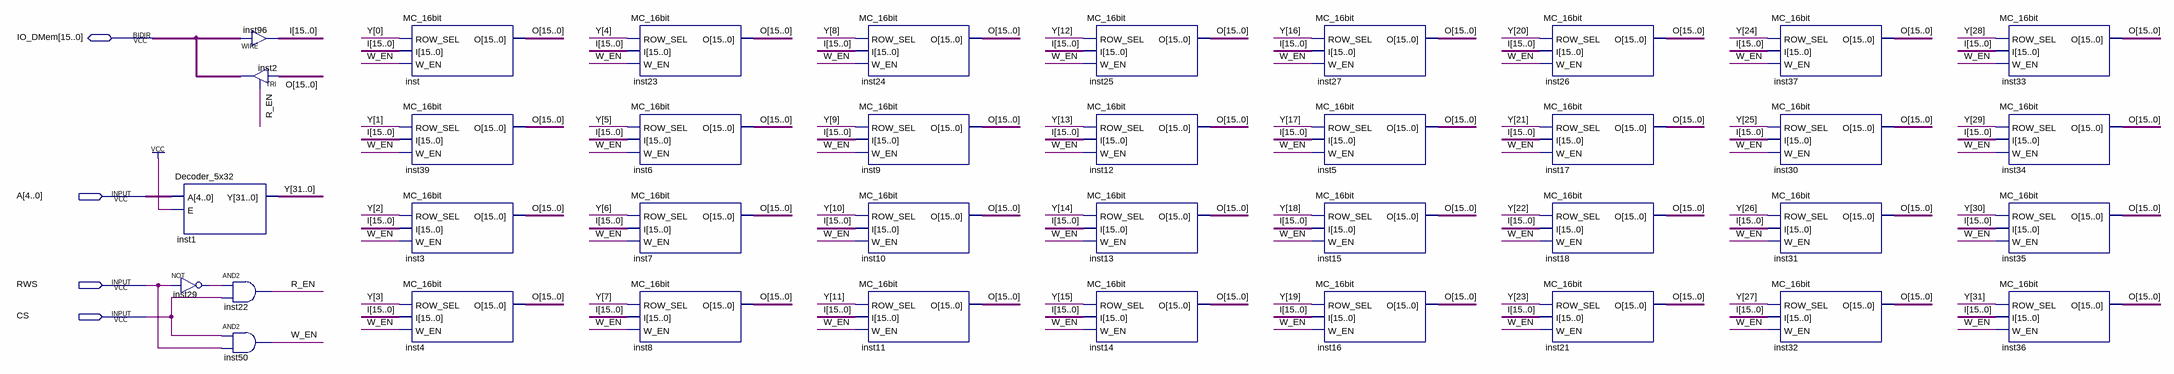
[diagram p0: schematic sheet]
// Quartus schematic DMem_32x16.bdf as structural Verilog: 38 symbols, 4 pins
module DMem_32x16 (
  input  [4:0] A,
  input  RWS,
  input  CS,
  inout  [15:0] IO_DMem
);

  wire inst29_out, R_EN, W_EN;
  wire [15:0] I, O;
  wire [31:0] Y;

  Decoder_5x32 inst1 (.A(A), .E(1'b1), .Y(Y));
  not inst29 (inst29_out, RWS);
  and inst22 (R_EN, inst29_out, CS);
  and inst50 (W_EN, CS, RWS);
  assign I = IO_DMem;  // WIRE inst96
  TRI inst2[15:0] (.IN(O), .OE(R_EN), .OUT(IO_DMem));
  MC_16bit inst (.ROW_SEL(Y[0]), .I(I), .W_EN(W_EN), .O(O));
  MC_16bit inst39 (.ROW_SEL(Y[1]), .I(I), .W_EN(W_EN), .O(O));
  MC_16bit inst3 (.ROW_SEL(Y[2]), .I(I), .W_EN(W_EN), .O(O));
  MC_16bit inst4 (.ROW_SEL(Y[3]), .I(I), .W_EN(W_EN), .O(O));
  MC_16bit inst23 (.ROW_SEL(Y[4]), .I(I), .W_EN(W_EN), .O(O));
  MC_16bit inst6 (.ROW_SEL(Y[5]), .I(I), .W_EN(W_EN), .O(O));
  MC_16bit inst7 (.ROW_SEL(Y[6]), .I(I), .W_EN(W_EN), .O(O));
  MC_16bit inst8 (.ROW_SEL(Y[7]), .I(I), .W_EN(W_EN), .O(O));
  MC_16bit inst24 (.ROW_SEL(Y[8]), .I(I), .W_EN(W_EN), .O(O));
  MC_16bit inst9 (.ROW_SEL(Y[9]), .I(I), .W_EN(W_EN), .O(O));
  MC_16bit inst10 (.ROW_SEL(Y[10]), .I(I), .W_EN(W_EN), .O(O));
  MC_16bit inst11 (.ROW_SEL(Y[11]), .I(I), .W_EN(W_EN), .O(O));
  MC_16bit inst25 (.ROW_SEL(Y[12]), .I(I), .W_EN(W_EN), .O(O));
  MC_16bit inst12 (.ROW_SEL(Y[13]), .I(I), .W_EN(W_EN), .O(O));
  MC_16bit inst13 (.ROW_SEL(Y[14]), .I(I), .W_EN(W_EN), .O(O));
  MC_16bit inst14 (.ROW_SEL(Y[15]), .I(I), .W_EN(W_EN), .O(O));
  MC_16bit inst27 (.ROW_SEL(Y[16]), .I(I), .W_EN(W_EN), .O(O));
  MC_16bit inst5 (.ROW_SEL(Y[17]), .I(I), .W_EN(W_EN), .O(O));
  MC_16bit inst15 (.ROW_SEL(Y[18]), .I(I), .W_EN(W_EN), .O(O));
  MC_16bit inst16 (.ROW_SEL(Y[19]), .I(I), .W_EN(W_EN), .O(O));
  MC_16bit inst26 (.ROW_SEL(Y[20]), .I(I), .W_EN(W_EN), .O(O));
  MC_16bit inst17 (.ROW_SEL(Y[21]), .I(I), .W_EN(W_EN), .O(O));
  MC_16bit inst18 (.ROW_SEL(Y[22]), .I(I), .W_EN(W_EN), .O(O));
  MC_16bit inst21 (.ROW_SEL(Y[23]), .I(I), .W_EN(W_EN), .O(O));
  MC_16bit inst37 (.ROW_SEL(Y[24]), .I(I), .W_EN(W_EN), .O(O));
  MC_16bit inst30 (.ROW_SEL(Y[25]), .I(I), .W_EN(W_EN), .O(O));
  MC_16bit inst31 (.ROW_SEL(Y[26]), .I(I), .W_EN(W_EN), .O(O));
  MC_16bit inst32 (.ROW_SEL(Y[27]), .I(I), .W_EN(W_EN), .O(O));
  MC_16bit inst33 (.ROW_SEL(Y[28]), .I(I), .W_EN(W_EN), .O(O));
  MC_16bit inst34 (.ROW_SEL(Y[29]), .I(I), .W_EN(W_EN), .O(O));
  MC_16bit inst35 (.ROW_SEL(Y[30]), .I(I), .W_EN(W_EN), .O(O));
  MC_16bit inst36 (.ROW_SEL(Y[31]), .I(I), .W_EN(W_EN), .O(O));
endmodule
